# EAGLE schematic button-wall (EAGLE 9.4.2)
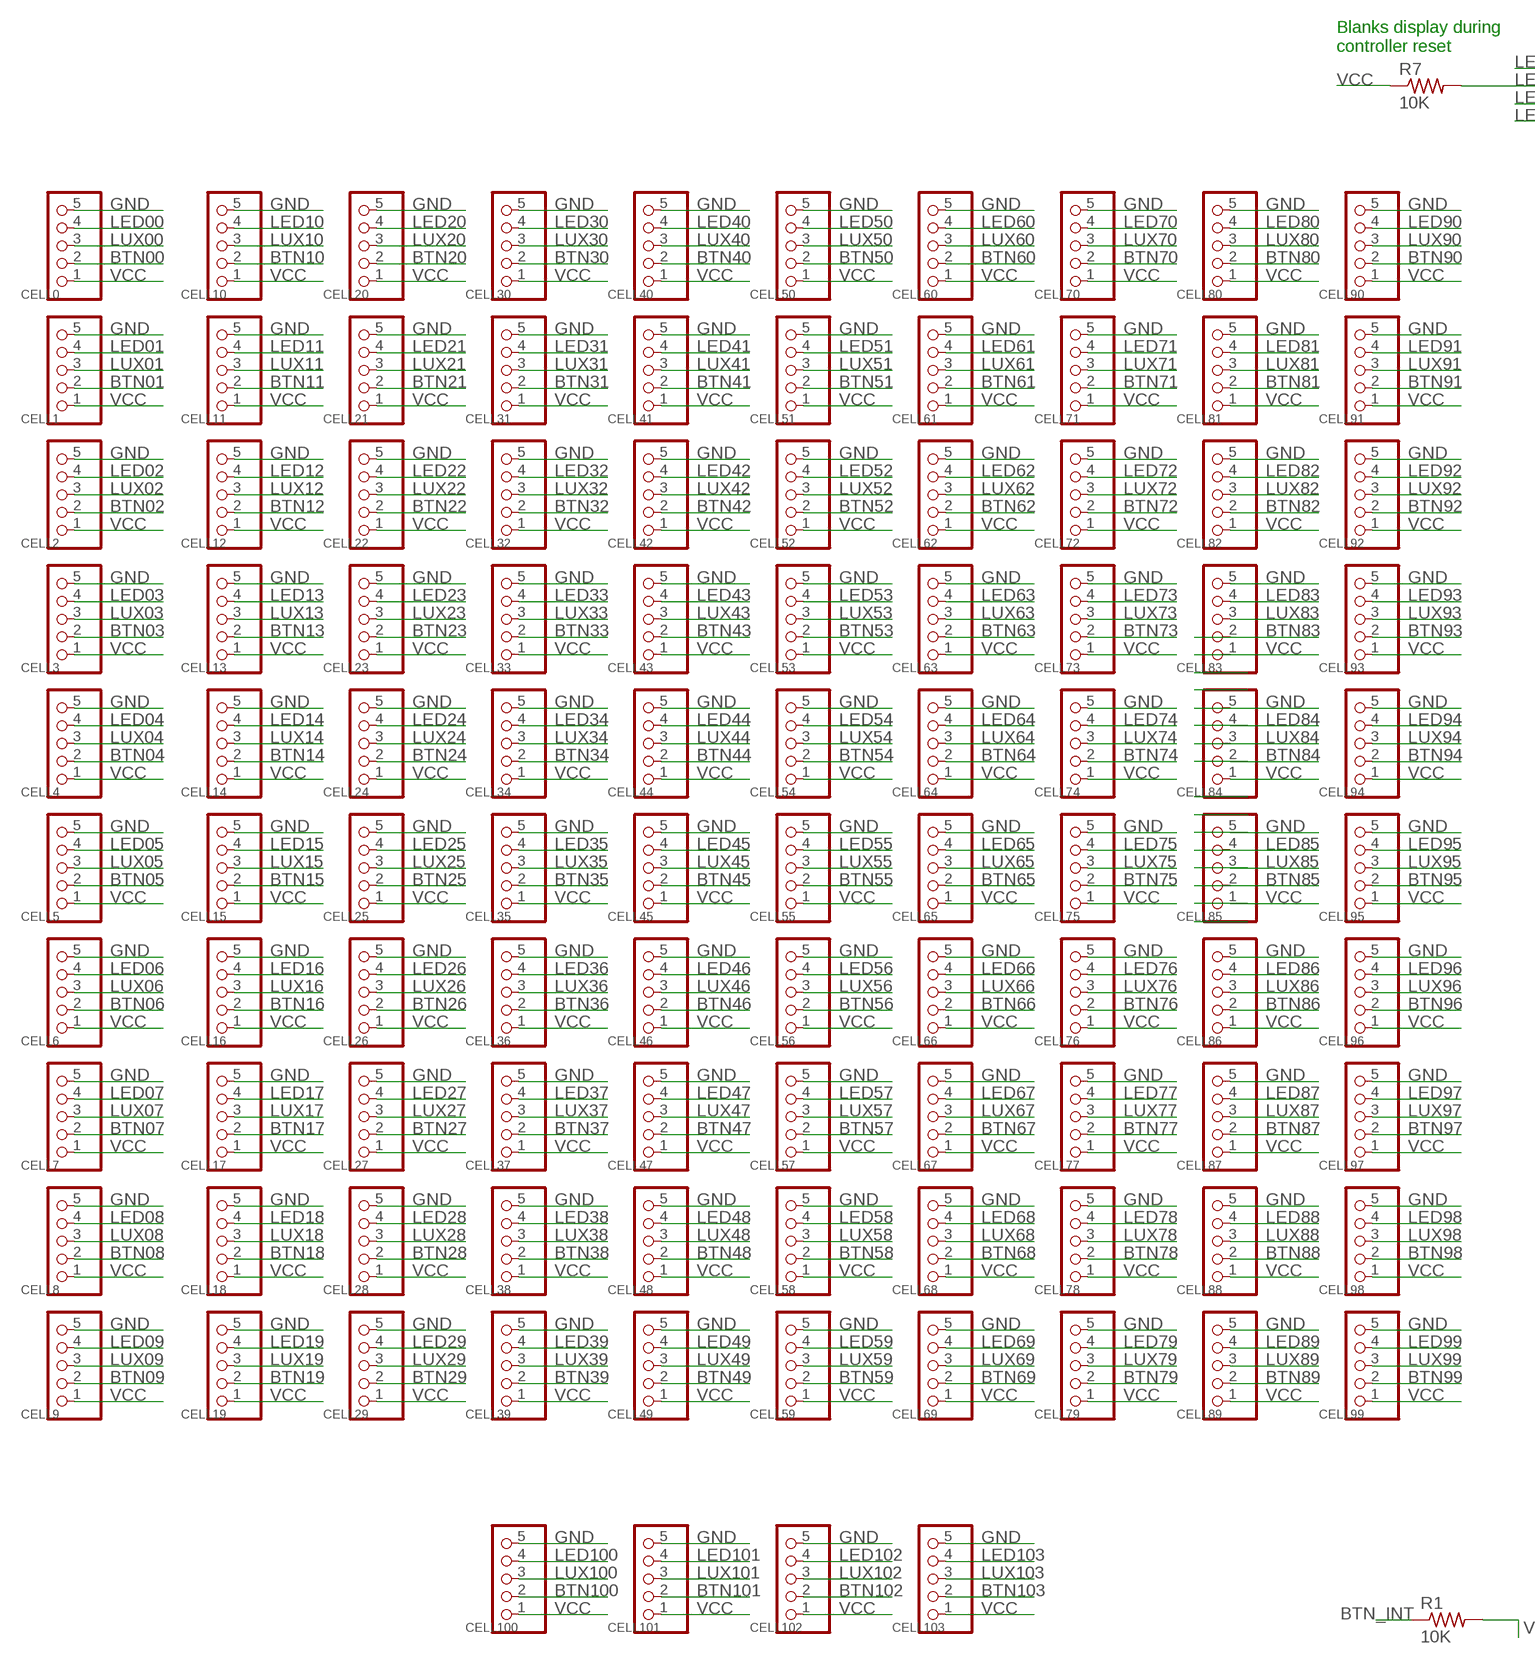
[diagram p0: schematic, sheet 1, part 1 of 2]
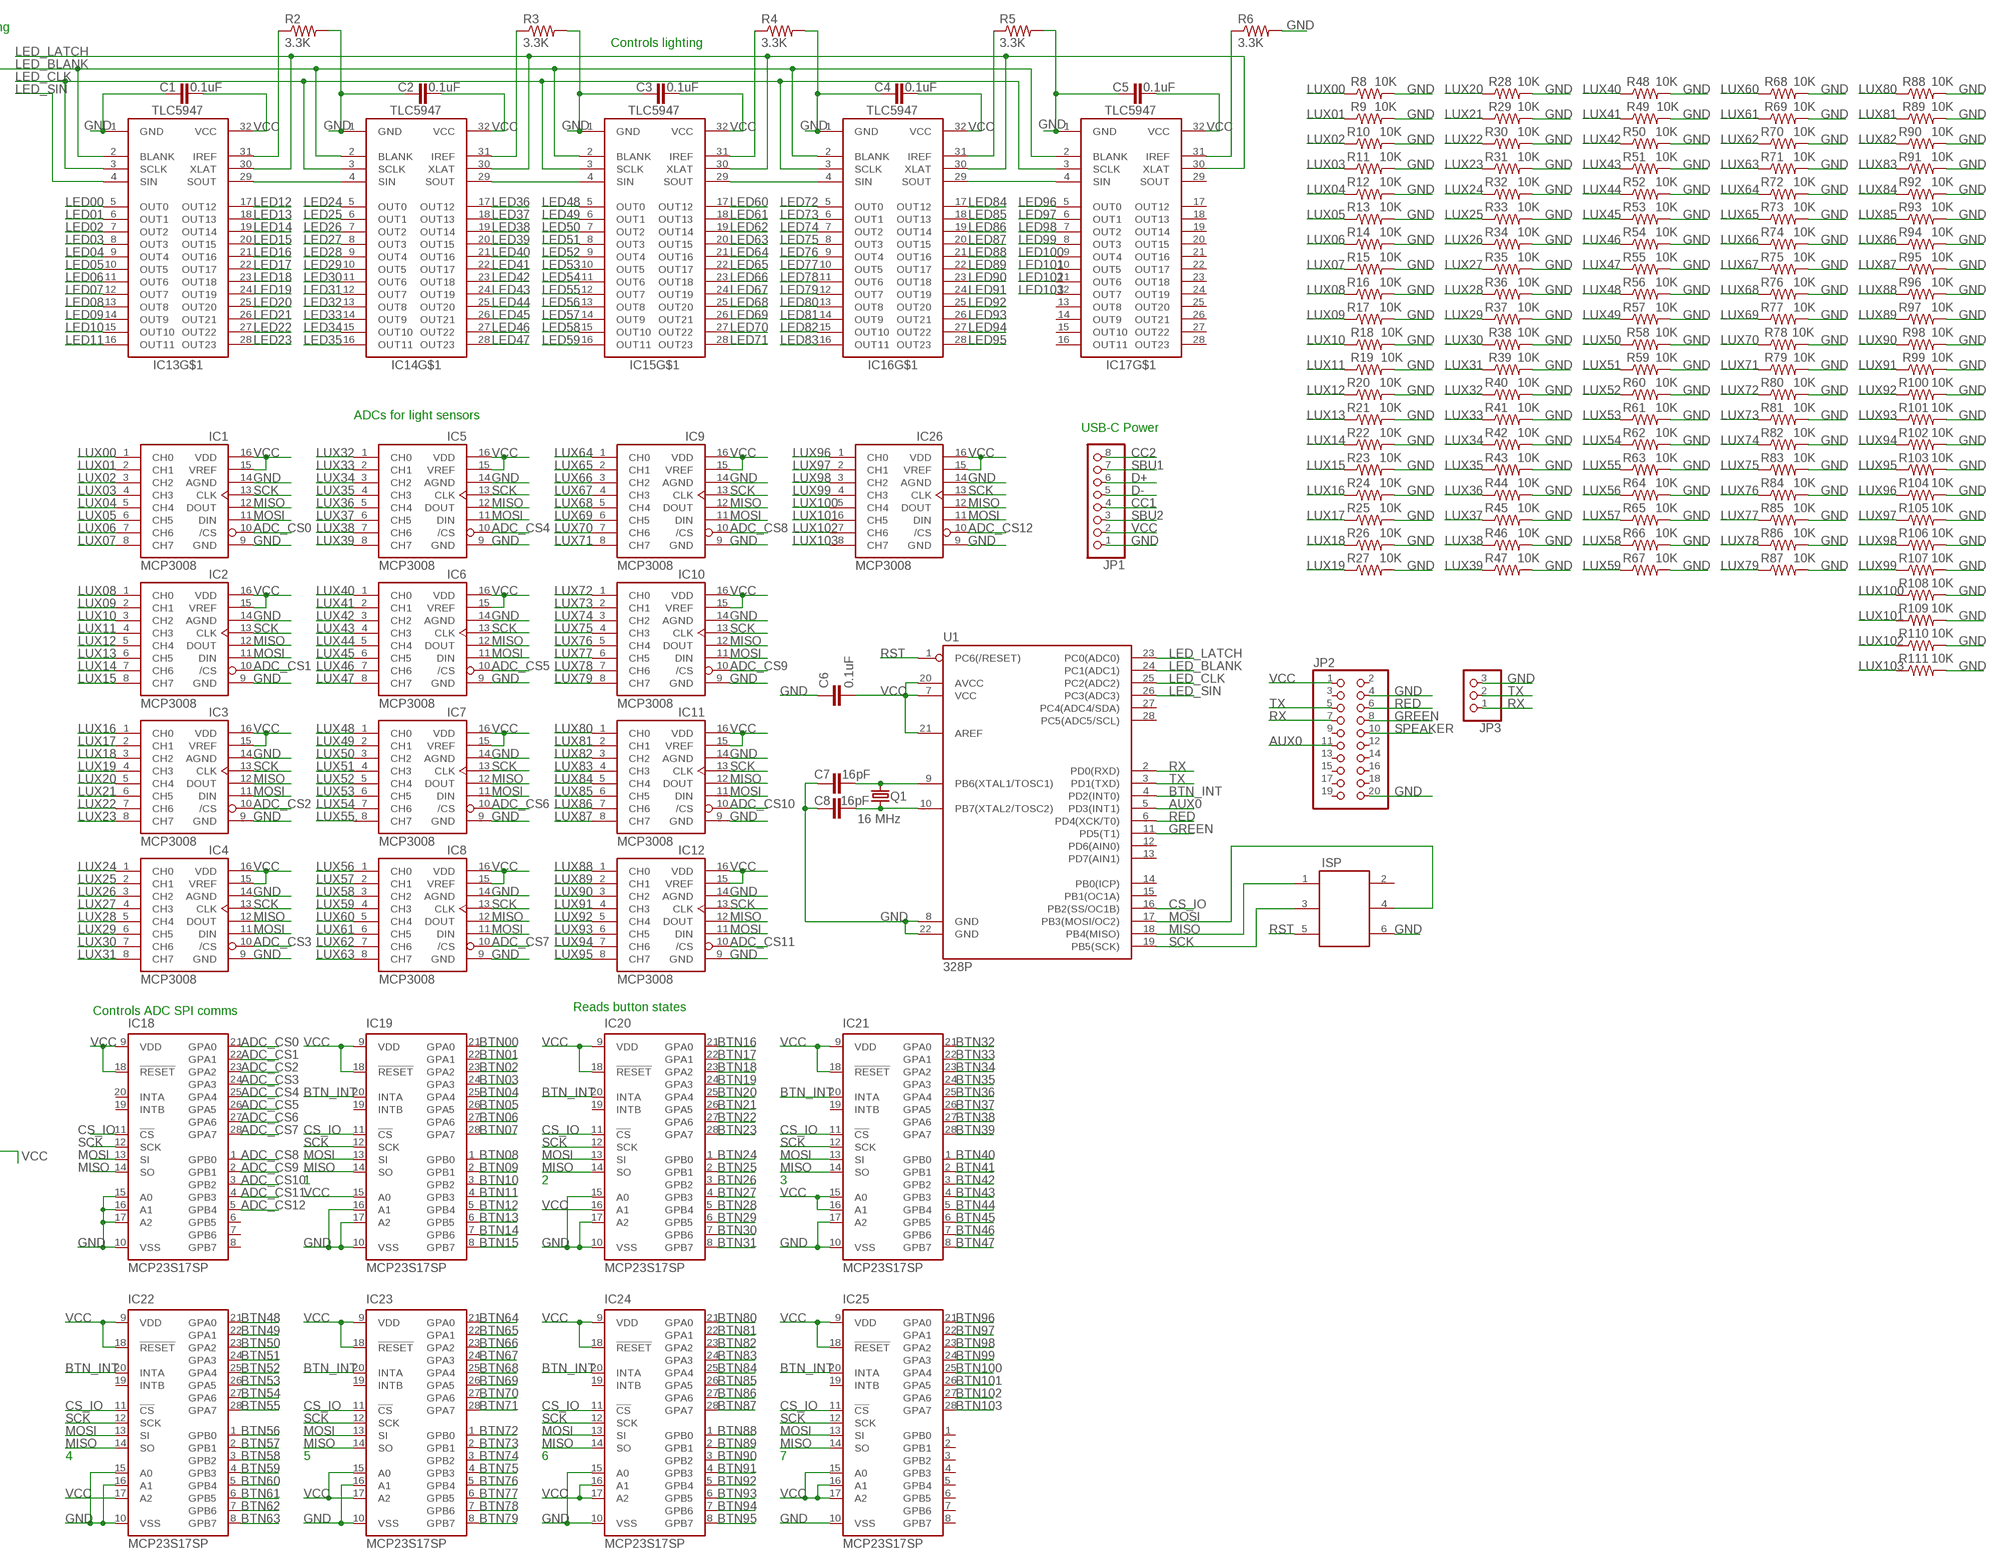
[diagram p1: schematic, sheet 1, part 2 of 2]

## Parts
C1  0.1uF  C-EUC1206  [C1206]
C2  0.1uF  C-EUC1206  [C1206]
C3  0.1uF  C-EUC1206  [C1206]
C4  0.1uF  C-EUC1206  [C1206]
C5  0.1uF  C-EUC1206  [C1206]
C6  0.1uF  C-EUC1206  [C1206]
C7  16pF  C-EUC0805  [C0805]
C8  16pF  C-EUC0805  [C0805]
CELL0  PINHD-1X55X2MM  [1_05X2MM]
CELL1  PINHD-1X55X2MM  [1_05X2MM]
CELL2  PINHD-1X55X2MM  [1_05X2MM]
CELL3  PINHD-1X55X2MM  [1_05X2MM]
CELL4  PINHD-1X55X2MM  [1_05X2MM]
CELL5  PINHD-1X55X2MM  [1_05X2MM]
CELL6  PINHD-1X55X2MM  [1_05X2MM]
CELL7  PINHD-1X55X2MM  [1_05X2MM]
CELL8  PINHD-1X55X2MM  [1_05X2MM]
CELL9  PINHD-1X55X2MM  [1_05X2MM]
CELL10  PINHD-1X55X2MM  [1_05X2MM]
CELL11  PINHD-1X55X2MM  [1_05X2MM]
CELL12  PINHD-1X55X2MM  [1_05X2MM]
CELL13  PINHD-1X55X2MM  [1_05X2MM]
CELL14  PINHD-1X55X2MM  [1_05X2MM]
CELL15  PINHD-1X55X2MM  [1_05X2MM]
CELL16  PINHD-1X55X2MM  [1_05X2MM]
CELL17  PINHD-1X55X2MM  [1_05X2MM]
CELL18  PINHD-1X55X2MM  [1_05X2MM]
CELL19  PINHD-1X55X2MM  [1_05X2MM]
CELL20  PINHD-1X55X2MM  [1_05X2MM]
CELL21  PINHD-1X55X2MM  [1_05X2MM]
CELL22  PINHD-1X55X2MM  [1_05X2MM]
CELL23  PINHD-1X55X2MM  [1_05X2MM]
CELL24  PINHD-1X55X2MM  [1_05X2MM]
CELL25  PINHD-1X55X2MM  [1_05X2MM]
CELL26  PINHD-1X55X2MM  [1_05X2MM]
CELL27  PINHD-1X55X2MM  [1_05X2MM]
CELL28  PINHD-1X55X2MM  [1_05X2MM]
CELL29  PINHD-1X55X2MM  [1_05X2MM]
CELL30  PINHD-1X55X2MM  [1_05X2MM]
CELL31  PINHD-1X55X2MM  [1_05X2MM]
CELL32  PINHD-1X55X2MM  [1_05X2MM]
CELL33  PINHD-1X55X2MM  [1_05X2MM]
CELL34  PINHD-1X55X2MM  [1_05X2MM]
CELL35  PINHD-1X55X2MM  [1_05X2MM]
CELL36  PINHD-1X55X2MM  [1_05X2MM]
CELL37  PINHD-1X55X2MM  [1_05X2MM]
CELL38  PINHD-1X55X2MM  [1_05X2MM]
CELL39  PINHD-1X55X2MM  [1_05X2MM]
CELL40  PINHD-1X55X2MM  [1_05X2MM]
CELL41  PINHD-1X55X2MM  [1_05X2MM]
CELL42  PINHD-1X55X2MM  [1_05X2MM]
CELL43  PINHD-1X55X2MM  [1_05X2MM]
CELL44  PINHD-1X55X2MM  [1_05X2MM]
CELL45  PINHD-1X55X2MM  [1_05X2MM]
CELL46  PINHD-1X55X2MM  [1_05X2MM]
CELL47  PINHD-1X55X2MM  [1_05X2MM]
CELL48  PINHD-1X55X2MM  [1_05X2MM]
CELL49  PINHD-1X55X2MM  [1_05X2MM]
CELL50  PINHD-1X55X2MM  [1_05X2MM]
CELL51  PINHD-1X55X2MM  [1_05X2MM]
CELL52  PINHD-1X55X2MM  [1_05X2MM]
CELL53  PINHD-1X55X2MM  [1_05X2MM]
CELL54  PINHD-1X55X2MM  [1_05X2MM]
CELL55  PINHD-1X55X2MM  [1_05X2MM]
CELL56  PINHD-1X55X2MM  [1_05X2MM]
CELL57  PINHD-1X55X2MM  [1_05X2MM]
CELL58  PINHD-1X55X2MM  [1_05X2MM]
CELL59  PINHD-1X55X2MM  [1_05X2MM]
CELL60  PINHD-1X55X2MM  [1_05X2MM]
CELL61  PINHD-1X55X2MM  [1_05X2MM]
CELL62  PINHD-1X55X2MM  [1_05X2MM]
CELL63  PINHD-1X55X2MM  [1_05X2MM]
CELL64  PINHD-1X55X2MM  [1_05X2MM]
CELL65  PINHD-1X55X2MM  [1_05X2MM]
CELL66  PINHD-1X55X2MM  [1_05X2MM]
CELL67  PINHD-1X55X2MM  [1_05X2MM]
CELL68  PINHD-1X55X2MM  [1_05X2MM]
CELL69  PINHD-1X55X2MM  [1_05X2MM]
CELL70  PINHD-1X55X2MM  [1_05X2MM]
CELL71  PINHD-1X55X2MM  [1_05X2MM]
CELL72  PINHD-1X55X2MM  [1_05X2MM]
CELL73  PINHD-1X55X2MM  [1_05X2MM]
CELL74  PINHD-1X55X2MM  [1_05X2MM]
CELL75  PINHD-1X55X2MM  [1_05X2MM]
CELL76  PINHD-1X55X2MM  [1_05X2MM]
CELL77  PINHD-1X55X2MM  [1_05X2MM]
CELL78  PINHD-1X55X2MM  [1_05X2MM]
CELL79  PINHD-1X55X2MM  [1_05X2MM]
CELL80  PINHD-1X55X2MM  [1_05X2MM]
CELL81  PINHD-1X55X2MM  [1_05X2MM]
CELL82  PINHD-1X55X2MM  [1_05X2MM]
CELL83  PINHD-1X55X2MM  [1_05X2MM]
CELL84  PINHD-1X55X2MM  [1_05X2MM]
CELL85  PINHD-1X55X2MM  [1_05X2MM]
CELL86  PINHD-1X55X2MM  [1_05X2MM]
CELL87  PINHD-1X55X2MM  [1_05X2MM]
CELL88  PINHD-1X55X2MM  [1_05X2MM]
CELL89  PINHD-1X55X2MM  [1_05X2MM]
CELL90  PINHD-1X55X2MM  [1_05X2MM]
CELL91  PINHD-1X55X2MM  [1_05X2MM]
CELL92  PINHD-1X55X2MM  [1_05X2MM]
CELL93  PINHD-1X55X2MM  [1_05X2MM]
CELL94  PINHD-1X55X2MM  [1_05X2MM]
CELL95  PINHD-1X55X2MM  [1_05X2MM]
CELL96  PINHD-1X55X2MM  [1_05X2MM]
CELL97  PINHD-1X55X2MM  [1_05X2MM]
CELL98  PINHD-1X55X2MM  [1_05X2MM]
CELL99  PINHD-1X55X2MM  [1_05X2MM]
CELL100  PINHD-1X55X2MM  [1_05X2MM]
CELL101  PINHD-1X55X2MM  [1_05X2MM]
CELL102  PINHD-1X55X2MM  [1_05X2MM]
CELL103  PINHD-1X55X2MM  [1_05X2MM]
IC1  MCP3008  [DIL16]
IC2  MCP3008  [DIL16]
IC3  MCP3008  [DIL16]
IC4  MCP3008  [DIL16]
IC5  MCP3008  [DIL16]
IC6  MCP3008  [DIL16]
IC7  MCP3008  [DIL16]
IC8  MCP3008  [DIL16]
IC9  MCP3008  [DIL16]
IC10  MCP3008  [DIL16]
IC11  MCP3008  [DIL16]
IC12  MCP3008  [DIL16]
IC13  TLC5947-DAP  [HTSSOP32DAP]
IC14  TLC5947-DAP  [HTSSOP32DAP]
IC15  TLC5947-DAP  [HTSSOP32DAP]
IC16  TLC5947-DAP  [HTSSOP32DAP]
IC17  TLC5947-DAP  [HTSSOP32DAP]
IC18  MCP23S17SP  [DIL28-3]
IC19  MCP23S17SP  [DIL28-3]
IC20  MCP23S17SP  [DIL28-3]
IC21  MCP23S17SP  [DIL28-3]
IC22  MCP23S17SP  [DIL28-3]
IC23  MCP23S17SP  [DIL28-3]
IC24  MCP23S17SP  [DIL28-3]
IC25  MCP23S17SP  [DIL28-3]
IC26  MCP3008  [DIL16]
ISP  61200621621  [61200621621]
JP1  PINHD-1X8CLEANBIG  [1X08-CLEANBIG]
JP2  PINHD-2X10  [2X10]
JP3  PINHD-1X3  [1X03]
Q1  16 MHz  CRYSTALHC49S  [HC49/S]
R1  10K  R-US_R1206  [R1206]
R2  3.3K  R-US_R1206  [R1206]
R3  3.3K  R-US_R1206  [R1206]
R4  3.3K  R-US_R1206  [R1206]
R5  3.3K  R-US_R1206  [R1206]
R6  3.3K  R-US_R1206  [R1206]
R7  10K  R-US_R1206  [R1206]
R8  10K  R-US_R0805  [R0805]
R9  10K  R-US_R0805  [R0805]
R10  10K  R-US_R0805  [R0805]
R11  10K  R-US_R0805  [R0805]
R12  10K  R-US_R0805  [R0805]
R13  10K  R-US_R0805  [R0805]
R14  10K  R-US_R0805  [R0805]
R15  10K  R-US_R0805  [R0805]
R16  10K  R-US_R0805  [R0805]
R17  10K  R-US_R0805  [R0805]
R18  10K  R-US_R0805  [R0805]
R19  10K  R-US_R0805  [R0805]
R20  10K  R-US_R0805  [R0805]
R21  10K  R-US_R0805  [R0805]
R22  10K  R-US_R0805  [R0805]
R23  10K  R-US_R0805  [R0805]
R24  10K  R-US_R0805  [R0805]
R25  10K  R-US_R0805  [R0805]
R26  10K  R-US_R0805  [R0805]
R27  10K  R-US_R0805  [R0805]
R28  10K  R-US_R0805  [R0805]
R29  10K  R-US_R0805  [R0805]
R30  10K  R-US_R0805  [R0805]
R31  10K  R-US_R0805  [R0805]
R32  10K  R-US_R0805  [R0805]
R33  10K  R-US_R0805  [R0805]
R34  10K  R-US_R0805  [R0805]
R35  10K  R-US_R0805  [R0805]
R36  10K  R-US_R0805  [R0805]
R37  10K  R-US_R0805  [R0805]
R38  10K  R-US_R0805  [R0805]
R39  10K  R-US_R0805  [R0805]
R40  10K  R-US_R0805  [R0805]
R41  10K  R-US_R0805  [R0805]
R42  10K  R-US_R0805  [R0805]
R43  10K  R-US_R0805  [R0805]
R44  10K  R-US_R0805  [R0805]
R45  10K  R-US_R0805  [R0805]
R46  10K  R-US_R0805  [R0805]
R47  10K  R-US_R0805  [R0805]
R48  10K  R-US_R0805  [R0805]
R49  10K  R-US_R0805  [R0805]
R50  10K  R-US_R0805  [R0805]
R51  10K  R-US_R0805  [R0805]
R52  10K  R-US_R0805  [R0805]
R53  10K  R-US_R0805  [R0805]
R54  10K  R-US_R0805  [R0805]
R55  10K  R-US_R0805  [R0805]
R56  10K  R-US_R0805  [R0805]
R57  10K  R-US_R0805  [R0805]
R58  10K  R-US_R0805  [R0805]
R59  10K  R-US_R0805  [R0805]
R60  10K  R-US_R0805  [R0805]
R61  10K  R-US_R0805  [R0805]
R62  10K  R-US_R0805  [R0805]
R63  10K  R-US_R0805  [R0805]
R64  10K  R-US_R0805  [R0805]
R65  10K  R-US_R0805  [R0805]
R66  10K  R-US_R0805  [R0805]
R67  10K  R-US_R0805  [R0805]
R68  10K  R-US_R0805  [R0805]
R69  10K  R-US_R0805  [R0805]
R70  10K  R-US_R0805  [R0805]
R71  10K  R-US_R0805  [R0805]
R72  10K  R-US_R0805  [R0805]
R73  10K  R-US_R0805  [R0805]
R74  10K  R-US_R0805  [R0805]
R75  10K  R-US_R0805  [R0805]
R76  10K  R-US_R0805  [R0805]
R77  10K  R-US_R0805  [R0805]
R78  10K  R-US_R0805  [R0805]
R79  10K  R-US_R0805  [R0805]
R80  10K  R-US_R0805  [R0805]
R81  10K  R-US_R0805  [R0805]
R82  10K  R-US_R0805  [R0805]
R83  10K  R-US_R0805  [R0805]
R84  10K  R-US_R0805  [R0805]
R85  10K  R-US_R0805  [R0805]
R86  10K  R-US_R0805  [R0805]
R87  10K  R-US_R0805  [R0805]
R88  10K  R-US_R0805  [R0805]
R89  10K  R-US_R0805  [R0805]
R90  10K  R-US_R0805  [R0805]
R91  10K  R-US_R0805  [R0805]
R92  10K  R-US_R0805  [R0805]
R93  10K  R-US_R0805  [R0805]
R94  10K  R-US_R0805  [R0805]
R95  10K  R-US_R0805  [R0805]
R96  10K  R-US_R0805  [R0805]
R97  10K  R-US_R0805  [R0805]
R98  10K  R-US_R0805  [R0805]
R99  10K  R-US_R0805  [R0805]
R100  10K  R-US_R0805  [R0805]
R101  10K  R-US_R0805  [R0805]
R102  10K  R-US_R0805  [R0805]
R103  10K  R-US_R0805  [R0805]
R104  10K  R-US_R0805  [R0805]
R105  10K  R-US_R0805  [R0805]
R106  10K  R-US_R0805  [R0805]
R107  10K  R-US_R0805  [R0805]
R108  10K  R-US_R0805  [R0805]
R109  10K  R-US_R0805  [R0805]
R110  10K  R-US_R0805  [R0805]
R111  10K  R-US_R0805  [R0805]
U1  328P  ATMEGA328P_PDIP  [DIP28]

## Nets
ADC_CS0: IC1.10(/CS) IC18.21(GPA0)
ADC_CS1: IC2.10(/CS) IC18.22(GPA1)
ADC_CS2: IC3.10(/CS) IC18.23(GPA2)
ADC_CS3: IC4.10(/CS) IC18.24(GPA3)
ADC_CS4: IC5.10(/CS) IC18.25(GPA4)
ADC_CS5: IC6.10(/CS) IC18.26(GPA5)
ADC_CS6: IC7.10(/CS) IC18.27(GPA6)
ADC_CS7: IC8.10(/CS) IC18.28(GPA7)
ADC_CS8: IC9.10(/CS) IC18.1(GPB0)
ADC_CS9: IC10.10(/CS) IC18.2(GPB1)
ADC_CS10: IC11.10(/CS) IC18.3(GPB2)
ADC_CS11: IC12.10(/CS) IC18.4(GPB3)
ADC_CS12: IC18.5(GPB4) IC26.10(/CS)
AUX0: JP2.11 U1.5(PD3(INT1))
BTN00: CELL0.2 IC19.21(GPA0)
BTN01: CELL1.2 IC19.22(GPA1)
BTN02: CELL2.2 IC19.23(GPA2)
BTN03: CELL3.2 IC19.24(GPA3)
BTN04: CELL4.2 IC19.25(GPA4)
BTN05: CELL5.2 IC19.26(GPA5)
BTN06: CELL6.2 IC19.27(GPA6)
BTN07: CELL7.2 IC19.28(GPA7)
BTN08: CELL8.2 IC19.1(GPB0)
BTN09: CELL9.2 IC19.2(GPB1)
BTN10: CELL10.2 IC19.3(GPB2)
BTN11: CELL11.2 IC19.4(GPB3)
BTN12: CELL12.2 IC19.5(GPB4)
BTN13: CELL13.2 IC19.6(GPB5)
BTN14: CELL14.2 IC19.7(GPB6)
BTN15: CELL15.2 IC19.8(GPB7)
BTN16: CELL16.2 IC20.21(GPA0)
BTN17: CELL17.2 IC20.22(GPA1)
BTN18: CELL18.2 IC20.23(GPA2)
BTN19: CELL19.2 IC20.24(GPA3)
BTN20: CELL20.2 IC20.25(GPA4)
BTN21: CELL21.2 IC20.26(GPA5)
BTN22: CELL22.2 IC20.27(GPA6)
BTN23: CELL23.2 IC20.28(GPA7)
BTN24: CELL24.2 IC20.1(GPB0)
BTN25: CELL25.2 IC20.2(GPB1)
BTN26: CELL26.2 IC20.3(GPB2)
BTN27: CELL27.2 IC20.4(GPB3)
BTN28: CELL28.2 IC20.5(GPB4)
BTN29: CELL29.2 IC20.6(GPB5)
BTN30: CELL30.2 IC20.7(GPB6)
BTN31: CELL31.2 IC20.8(GPB7)
BTN32: CELL32.2 IC21.21(GPA0)
BTN33: CELL33.2 IC21.22(GPA1)
BTN34: CELL34.2 IC21.23(GPA2)
BTN35: CELL35.2 IC21.24(GPA3)
BTN36: CELL36.2 IC21.25(GPA4)
BTN37: CELL37.2 IC21.26(GPA5)
BTN38: CELL38.2 IC21.27(GPA6)
BTN39: CELL39.2 IC21.28(GPA7)
BTN40: CELL40.2 IC21.1(GPB0)
BTN41: CELL41.2 IC21.2(GPB1)
BTN42: CELL42.2 IC21.3(GPB2)
BTN43: CELL43.2 IC21.4(GPB3)
BTN44: CELL44.2 IC21.5(GPB4)
BTN45: CELL45.2 IC21.6(GPB5)
BTN46: CELL46.2 IC21.7(GPB6)
BTN47: CELL47.2 IC21.8(GPB7)
BTN48: CELL48.2 IC22.21(GPA0)
BTN49: CELL49.2 IC22.22(GPA1)
BTN50: CELL50.2 IC22.23(GPA2)
BTN51: CELL51.2 IC22.24(GPA3)
BTN52: CELL52.2 IC22.25(GPA4)
BTN53: CELL53.2 IC22.26(GPA5)
BTN54: CELL54.2 IC22.27(GPA6)
BTN55: CELL55.2 IC22.28(GPA7)
BTN56: CELL56.2 IC22.1(GPB0)
BTN57: CELL57.2 IC22.2(GPB1)
BTN58: CELL58.2 IC22.3(GPB2)
BTN59: CELL59.2 IC22.4(GPB3)
BTN60: CELL60.2 IC22.5(GPB4)
BTN61: CELL61.2 IC22.6(GPB5)
BTN62: CELL62.2 IC22.7(GPB6)
BTN63: CELL63.2 IC22.8(GPB7)
BTN64: CELL64.2 IC23.21(GPA0)
BTN65: CELL65.2 IC23.22(GPA1)
BTN66: CELL66.2 IC23.23(GPA2)
BTN67: CELL67.2 IC23.24(GPA3)
BTN68: CELL68.2 IC23.25(GPA4)
BTN69: CELL69.2 IC23.26(GPA5)
BTN70: CELL70.2 IC23.27(GPA6)
BTN71: CELL71.2 IC23.28(GPA7)
BTN72: CELL72.2 IC23.1(GPB0)
BTN73: CELL73.2 IC23.2(GPB1)
BTN74: CELL74.2 IC23.3(GPB2)
BTN75: CELL75.2 IC23.4(GPB3)
BTN76: CELL76.2 IC23.5(GPB4)
BTN77: CELL77.2 IC23.6(GPB5)
BTN78: CELL78.2 IC23.7(GPB6)
BTN79: CELL79.2 IC23.8(GPB7)
BTN80: CELL80.2 IC24.21(GPA0)
BTN81: CELL81.2 IC24.22(GPA1)
BTN82: CELL82.2 IC24.23(GPA2)
BTN83: CELL83.2 IC24.24(GPA3)
BTN84: CELL84.2 IC24.25(GPA4)
BTN85: CELL85.2 IC24.26(GPA5)
BTN86: CELL86.2 IC24.27(GPA6)
BTN87: CELL87.2 IC24.28(GPA7)
BTN88: CELL88.2 IC24.1(GPB0)
BTN89: CELL89.2 IC24.2(GPB1)
BTN90: CELL90.2 IC24.3(GPB2)
BTN91: CELL91.2 IC24.4(GPB3)
BTN92: CELL92.2 IC24.5(GPB4)
BTN93: CELL93.2 IC24.6(GPB5)
BTN94: CELL94.2 IC24.7(GPB6)
BTN95: CELL95.2 IC24.8(GPB7)
BTN96: CELL96.2 IC25.21(GPA0)
BTN97: CELL97.2 IC25.22(GPA1)
BTN98: CELL98.2 IC25.23(GPA2)
BTN99: CELL99.2 IC25.24(GPA3)
BTN100: CELL100.2 IC25.25(GPA4)
BTN101: CELL101.2 IC25.26(GPA5)
BTN102: CELL102.2 IC25.27(GPA6)
BTN103: CELL103.2 IC25.28(GPA7)
BTN_INT: IC19.20(INTA) IC20.20(INTA) IC21.20(INTA) IC22.20(INTA) IC23.20(INTA) IC24.20(INTA) IC25.20(INTA) R1.1 U1.4(PD2(INT0))
CC1: JP1.4
CC2: JP1.8
CS_IO: IC18.11(!CS) IC19.11(!CS) IC20.11(!CS) IC21.11(!CS) IC22.11(!CS) IC23.11(!CS) IC24.11(!CS) IC25.11(!CS) U1.16(PB2(SS/OC1B))
D+: JP1.6
D-: JP1.5
GND: C1.1 C2.1 C3.1 C4.1 C5.1 C6.1 C7.1 C8.1 CELL0.5 CELL1.5 CELL2.5 CELL3.5 CELL4.5 CELL5.5 CELL6.5 CELL7.5 CELL8.5 CELL9.5 CELL10.5 CELL11.5 CELL12.5 CELL13.5 CELL14.5 CELL15.5 CELL16.5 CELL17.5 CELL18.5 CELL19.5 CELL20.5 CELL21.5 CELL22.5 CELL23.5 CELL24.5 CELL25.5 CELL26.5 CELL27.5 CELL28.5 CELL29.5 CELL30.5 CELL31.5 CELL32.5 CELL33.5 CELL34.5 CELL35.5 CELL36.5 CELL37.5 CELL38.5 CELL39.5 CELL40.5 CELL41.5 CELL42.5 CELL43.5 CELL44.5 CELL45.5 CELL46.5 CELL47.5 CELL48.5 CELL49.5 CELL50.5 CELL51.5 CELL52.5 CELL53.5 CELL54.5 CELL55.5 CELL56.5 CELL57.5 CELL58.5 CELL59.5 CELL60.5 CELL61.5 CELL62.5 CELL63.5 CELL64.5 CELL65.5 CELL66.5 CELL67.5 CELL68.5 CELL69.5 CELL70.5 CELL71.5 CELL72.5 CELL73.5 CELL74.5 CELL75.5 CELL76.5 CELL77.5 CELL78.5 CELL79.5 CELL80.5 CELL81.5 CELL82.5 CELL83.5 CELL84.5 CELL85.5 CELL86.5 CELL87.5 CELL88.5 CELL89.5 CELL90.5 CELL91.5 CELL92.5 CELL93.5 CELL94.5 CELL95.5 CELL96.5 CELL97.5 CELL98.5 CELL99.5 CELL100.5 CELL101.5 CELL102.5 CELL103.5 IC1.9(GND) IC1.14(AGND) IC2.9(GND) IC2.14(AGND) IC3.9(GND) IC3.14(AGND) IC4.9(GND) IC4.14(AGND) IC5.9(GND) IC5.14(AGND) IC6.9(GND) IC6.14(AGND) IC7.9(GND) IC7.14(AGND) IC8.9(GND) IC8.14(AGND) IC9.9(GND) IC9.14(AGND) IC10.9(GND) IC10.14(AGND) IC11.9(GND) IC11.14(AGND) IC12.9(GND) IC12.14(AGND) IC13.1(GND) IC14.1(GND) IC15.1(GND) IC16.1(GND) IC17.1(GND) IC18.10(VSS) IC18.15(A0) IC18.16(A1) IC18.17(A2) IC19.10(VSS) IC19.16(A1) IC19.17(A2) IC20.10(VSS) IC20.15(A0) IC20.17(A2) IC21.10(VSS) IC21.17(A2) IC22.10(VSS) IC22.15(A0) IC22.16(A1) IC23.10(VSS) IC23.16(A1) IC24.10(VSS) IC24.15(A0) IC25.10(VSS) IC26.9(GND) IC26.14(AGND) ISP.6 JP1.1 JP2.4 JP2.20 JP3.3 R2.2 R3.2 R4.2 R5.2 R6.2 R8.2 R9.2 R10.2 R11.2 R12.2 R13.2 R14.2 R15.2 R16.2 R17.2 R18.2 R19.2 R20.2 R21.2 R22.2 R23.2 R24.2 R25.2 R26.2 R27.2 R28.2 R29.2 R30.2 R31.2 R32.2 R33.2 R34.2 R35.2 R36.2 R37.2 R38.2 R39.2 R40.2 R41.2 R42.2 R43.2 R44.2 R45.2 R46.2 R47.2 R48.2 R49.2 R50.2 R51.2 R52.2 R53.2 R54.2 R55.2 R56.2 R57.2 R58.2 R59.2 R60.2 R61.2 R62.2 R63.2 R64.2 R65.2 R66.2 R67.2 R68.2 R69.2 R70.2 R71.2 R72.2 R73.2 R74.2 R75.2 R76.2 R77.2 R78.2 R79.2 R80.2 R81.2 R82.2 R83.2 R84.2 R85.2 R86.2 R87.2 R88.2 R89.2 R90.2 R91.2 R92.2 R93.2 R94.2 R95.2 R96.2 R97.2 R98.2 R99.2 R100.2 R101.2 R102.2 R103.2 R104.2 R105.2 R106.2 R107.2 R108.2 R109.2 R110.2 R111.2 U1.8(GND) U1.22(GND)
GREEN: JP2.8 U1.11(PD5(T1))
LED00: CELL0.4 IC13.5(OUT0)
LED01: CELL1.4 IC13.6(OUT1)
LED02: CELL2.4 IC13.7(OUT2)
LED03: CELL3.4 IC13.8(OUT3)
LED04: CELL4.4 IC13.9(OUT4)
LED05: CELL5.4 IC13.10(OUT5)
LED06: CELL6.4 IC13.11(OUT6)
LED07: CELL7.4 IC13.12(OUT7)
LED08: CELL8.4 IC13.13(OUT8)
LED09: CELL9.4 IC13.14(OUT9)
LED10: CELL10.4 IC13.15(OUT10)
LED11: CELL11.4 IC13.16(OUT11)
LED12: CELL12.4 IC13.17(OUT12)
LED13: CELL13.4 IC13.18(OUT13)
LED14: CELL14.4 IC13.19(OUT14)
LED15: CELL15.4 IC13.20(OUT15)
LED16: CELL16.4 IC13.21(OUT16)
LED17: CELL17.4 IC13.22(OUT17)
LED18: CELL18.4 IC13.23(OUT18)
LED19: CELL19.4 IC13.24(OUT19)
LED20: CELL20.4 IC13.25(OUT20)
LED21: CELL21.4 IC13.26(OUT21)
LED22: CELL22.4 IC13.27(OUT22)
LED23: CELL23.4 IC13.28(OUT23)
LED24: CELL24.4 IC14.5(OUT0)
LED25: CELL25.4 IC14.6(OUT1)
LED26: CELL26.4 IC14.7(OUT2)
LED27: CELL27.4 IC14.8(OUT3)
LED28: CELL28.4 IC14.9(OUT4)
LED29: CELL29.4 IC14.10(OUT5)
LED30: CELL30.4 IC14.11(OUT6)
LED31: CELL31.4 IC14.12(OUT7)
LED32: CELL32.4 IC14.13(OUT8)
LED33: CELL33.4 IC14.14(OUT9)
LED34: CELL34.4 IC14.15(OUT10)
LED35: CELL35.4 IC14.16(OUT11)
LED36: CELL36.4 IC14.17(OUT12)
LED37: CELL37.4 IC14.18(OUT13)
LED38: CELL38.4 IC14.19(OUT14)
LED39: CELL39.4 IC14.20(OUT15)
LED40: CELL40.4 IC14.21(OUT16)
LED41: CELL41.4 IC14.22(OUT17)
LED42: CELL42.4 IC14.23(OUT18)
LED43: CELL43.4 IC14.24(OUT19)
LED44: CELL44.4 IC14.25(OUT20)
LED45: CELL45.4 IC14.26(OUT21)
LED46: CELL46.4 IC14.27(OUT22)
LED47: CELL47.4 IC14.28(OUT23)
LED48: CELL48.4 IC15.5(OUT0)
LED49: CELL49.4 IC15.6(OUT1)
LED50: CELL50.4 IC15.7(OUT2)
LED51: CELL51.4 IC15.8(OUT3)
LED52: CELL52.4 IC15.9(OUT4)
LED53: CELL53.4 IC15.10(OUT5)
LED54: CELL54.4 IC15.11(OUT6)
LED55: CELL55.4 IC15.12(OUT7)
LED56: CELL56.4 IC15.13(OUT8)
LED57: CELL57.4 IC15.14(OUT9)
LED58: CELL58.4 IC15.15(OUT10)
LED59: CELL59.4 IC15.16(OUT11)
LED60: CELL60.4 IC15.17(OUT12)
LED61: CELL61.4 IC15.18(OUT13)
LED62: CELL62.4 IC15.19(OUT14)
LED63: CELL63.4 IC15.20(OUT15)
LED64: CELL64.4 IC15.21(OUT16)
LED65: CELL65.4 IC15.22(OUT17)
LED66: CELL66.4 IC15.23(OUT18)
LED67: CELL67.4 IC15.24(OUT19)
LED68: CELL68.4 IC15.25(OUT20)
LED69: CELL69.4 IC15.26(OUT21)
LED70: CELL70.4 IC15.27(OUT22)
LED71: CELL71.4 IC15.28(OUT23)
LED72: CELL72.4 IC16.5(OUT0)
LED73: CELL73.4 IC16.6(OUT1)
LED74: CELL74.4 IC16.7(OUT2)
LED75: CELL75.4 IC16.8(OUT3)
LED76: CELL76.4 IC16.9(OUT4)
LED77: CELL77.4 IC16.10(OUT5)
LED78: CELL78.4 IC16.11(OUT6)
LED79: CELL79.4 IC16.12(OUT7)
LED80: CELL80.4 IC16.13(OUT8)
LED81: CELL81.4 IC16.14(OUT9)
LED82: CELL82.4 IC16.15(OUT10)
LED83: CELL83.4 IC16.16(OUT11)
LED84: CELL84.4 IC16.17(OUT12)
LED85: CELL85.4 IC16.18(OUT13)
LED86: CELL86.4 IC16.19(OUT14)
LED87: CELL87.4 IC16.20(OUT15)
LED88: CELL88.4 IC16.21(OUT16)
LED89: CELL89.4 IC16.22(OUT17)
LED90: CELL90.4 IC16.23(OUT18)
LED91: CELL91.4 IC16.24(OUT19)
LED92: CELL92.4 IC16.25(OUT20)
LED93: CELL93.4 IC16.26(OUT21)
LED94: CELL94.4 IC16.27(OUT22)
LED95: CELL95.4 IC16.28(OUT23)
LED96: CELL96.4 IC17.5(OUT0)
LED97: CELL97.4 IC17.6(OUT1)
LED98: CELL98.4 IC17.7(OUT2)
LED99: CELL99.4 IC17.8(OUT3)
LED100: CELL100.4 IC17.9(OUT4)
LED101: CELL101.4 IC17.10(OUT5)
LED102: CELL102.4 IC17.11(OUT6)
LED103: CELL103.4 IC17.12(OUT7)
LED_BLANK: IC13.2(BLANK) IC14.2(BLANK) IC15.2(BLANK) IC16.2(BLANK) IC17.2(BLANK) R7.2 U1.24(PC1(ADC1))
LED_CLK: IC13.3(SCLK) IC14.3(SCLK) IC15.3(SCLK) IC16.3(SCLK) IC17.3(SCLK) U1.25(PC2(ADC2))
LED_LATCH: IC13.30(XLAT) IC14.30(XLAT) IC15.30(XLAT) IC16.30(XLAT) IC17.30(XLAT) U1.23(PC0(ADC0))
LED_SIN: IC13.4(SIN) U1.26(PC3(ADC3))
LUX00: CELL0.3 IC1.1(CH0) R8.1
LUX01: CELL1.3 IC1.2(CH1) R9.1
LUX02: CELL2.3 IC1.3(CH2) R10.1
LUX03: CELL3.3 IC1.4(CH3) R11.1
LUX04: CELL4.3 IC1.5(CH4) R12.1
LUX05: CELL5.3 IC1.6(CH5) R13.1
LUX06: CELL6.3 IC1.7(CH6) R14.1
LUX07: CELL7.3 IC1.8(CH7) R15.1
LUX08: CELL8.3 IC2.1(CH0) R16.1
LUX09: CELL9.3 IC2.2(CH1) R17.1
LUX10: CELL10.3 IC2.3(CH2) R18.1
LUX11: CELL11.3 IC2.4(CH3) R19.1
LUX12: CELL12.3 IC2.5(CH4) R20.1
LUX13: CELL13.3 IC2.6(CH5) R21.1
LUX14: CELL14.3 IC2.7(CH6) R22.1
LUX15: CELL15.3 IC2.8(CH7) R23.1
LUX16: CELL16.3 IC3.1(CH0) R24.1
LUX17: CELL17.3 IC3.2(CH1) R25.1
LUX18: CELL18.3 IC3.3(CH2) R26.1
LUX19: CELL19.3 IC3.4(CH3) R27.1
LUX20: CELL20.3 IC3.5(CH4) R28.1
LUX21: CELL21.3 IC3.6(CH5) R29.1
LUX22: CELL22.3 IC3.7(CH6) R30.1
LUX23: CELL23.3 IC3.8(CH7) R31.1
LUX24: CELL24.3 IC4.1(CH0) R32.1
LUX25: CELL25.3 IC4.2(CH1) R33.1
LUX26: CELL26.3 IC4.3(CH2) R34.1
LUX27: CELL27.3 IC4.4(CH3) R35.1
LUX28: CELL28.3 IC4.5(CH4) R36.1
LUX29: CELL29.3 IC4.6(CH5) R37.1
LUX30: CELL30.3 IC4.7(CH6) R38.1
LUX31: CELL31.3 IC4.8(CH7) R39.1
LUX32: CELL32.3 IC5.1(CH0) R40.1
LUX33: CELL33.3 IC5.2(CH1) R41.1
LUX34: CELL34.3 IC5.3(CH2) R42.1
LUX35: CELL35.3 IC5.4(CH3) R43.1
LUX36: CELL36.3 IC5.5(CH4) R44.1
LUX37: CELL37.3 IC5.6(CH5) R45.1
LUX38: CELL38.3 IC5.7(CH6) R46.1
LUX39: CELL39.3 IC5.8(CH7) R47.1
LUX40: CELL40.3 IC6.1(CH0) R48.1
LUX41: CELL41.3 IC6.2(CH1) R49.1
LUX42: CELL42.3 IC6.3(CH2) R50.1
LUX43: CELL43.3 IC6.4(CH3) R51.1
LUX44: CELL44.3 IC6.5(CH4) R52.1
LUX45: CELL45.3 IC6.6(CH5) R53.1
LUX46: CELL46.3 IC6.7(CH6) R54.1
LUX47: CELL47.3 IC6.8(CH7) R55.1
LUX48: CELL48.3 IC7.1(CH0) R56.1
LUX49: CELL49.3 IC7.2(CH1) R57.1
LUX50: CELL50.3 IC7.3(CH2) R58.1
LUX51: CELL51.3 IC7.4(CH3) R59.1
LUX52: CELL52.3 IC7.5(CH4) R60.1
LUX53: CELL53.3 IC7.6(CH5) R61.1
LUX54: CELL54.3 IC7.7(CH6) R62.1
LUX55: CELL55.3 R63.1
LUX55.: IC7.8(CH7)
LUX56: CELL56.3 IC8.1(CH0) R64.1
LUX57: CELL57.3 IC8.2(CH1) R65.1
LUX58: CELL58.3 IC8.3(CH2) R66.1
LUX59: CELL59.3 IC8.4(CH3) R67.1
LUX60: CELL60.3 IC8.5(CH4) R68.1
LUX61: CELL61.3 IC8.6(CH5) R69.1
LUX62: CELL62.3 IC8.7(CH6) R70.1
LUX63: CELL63.3 IC8.8(CH7) R71.1
LUX64: CELL64.3 IC9.1(CH0) R72.1
LUX65: CELL65.3 IC9.2(CH1) R73.1
LUX66: CELL66.3 IC9.3(CH2) R74.1
LUX67: CELL67.3 IC9.4(CH3) R75.1
LUX68: CELL68.3 IC9.5(CH4) R76.1
LUX69: CELL69.3 IC9.6(CH5) R77.1
LUX70: CELL70.3 IC9.7(CH6) R78.1
LUX71: CELL71.3 IC9.8(CH7) R79.1
LUX72: CELL72.3 IC10.1(CH0) R80.1
LUX73: CELL73.3 IC10.2(CH1) R81.1
LUX74: CELL74.3 IC10.3(CH2) R82.1
LUX75: CELL75.3 IC10.4(CH3) R83.1
LUX76: CELL76.3 IC10.5(CH4) R84.1
LUX77: CELL77.3 IC10.6(CH5) R85.1
LUX78: CELL78.3 IC10.7(CH6) R86.1
LUX79: CELL79.3 IC10.8(CH7) R87.1
LUX80: CELL80.3 IC11.1(CH0) R88.1
LUX81: CELL81.3 IC11.2(CH1) R89.1
LUX82: CELL82.3 IC11.3(CH2) R90.1
LUX83: CELL83.3 IC11.4(CH3) R91.1
LUX84: CELL84.3 IC11.5(CH4) R92.1
LUX85: CELL85.3 IC11.6(CH5) R93.1
LUX86: CELL86.3 IC11.7(CH6) R94.1
LUX87: CELL87.3 IC11.8(CH7) R95.1
LUX88: CELL88.3 IC12.1(CH0) R96.1
LUX89: CELL89.3 IC12.2(CH1) R97.1
LUX90: CELL90.3 IC12.3(CH2) R98.1
LUX91: CELL91.3 IC12.4(CH3) R99.1
LUX92: CELL92.3 IC12.5(CH4) R100.1
LUX93: CELL93.3 IC12.6(CH5) R101.1
LUX94: CELL94.3 IC12.7(CH6) R102.1
LUX95: CELL95.3 IC12.8(CH7) R103.1
LUX96: CELL96.3 IC26.1(CH0) R104.1
LUX97: CELL97.3 IC26.2(CH1) R105.1
LUX98: CELL98.3 IC26.3(CH2) R106.1
LUX99: CELL99.3 IC26.4(CH3) R107.1
LUX100: CELL100.3 IC26.5(CH4) R108.1
LUX101: CELL101.3 IC26.6(CH5) R109.1
LUX102: CELL102.3 IC26.7(CH6) R110.1
LUX103: CELL103.3 IC26.8(CH7) R111.1
MISO: IC1.12(DOUT) IC2.12(DOUT) IC3.12(DOUT) IC4.12(DOUT) IC5.12(DOUT) IC6.12(DOUT) IC7.12(DOUT) IC8.12(DOUT) IC9.12(DOUT) IC10.12(DOUT) IC11.12(DOUT) IC12.12(DOUT) IC18.14(SO) IC19.14(SO) IC20.14(SO) IC21.14(SO) IC22.14(SO) IC23.14(SO) IC24.14(SO) IC25.14(SO) IC26.12(DOUT) ISP.1 U1.18(PB4(MISO))
MOSI: IC1.11(DIN) IC2.11(DIN) IC3.11(DIN) IC4.11(DIN) IC5.11(DIN) IC6.11(DIN) IC7.11(DIN) IC8.11(DIN) IC9.11(DIN) IC10.11(DIN) IC11.11(DIN) IC12.11(DIN) IC18.13(SI) IC19.13(SI) IC20.13(SI) IC21.13(SI) IC22.13(SI) IC23.13(SI) IC24.13(SI) IC25.13(SI) IC26.11(DIN) ISP.4 U1.17(PB3(MOSI/OC2))
N$1: IC13.31(IREF) R2.1
N$2: C7.2 Q1.2 U1.9(PB6(XTAL1/TOSC1))
N$3: C8.2 Q1.1 U1.10(PB7(XTAL2/TOSC2))
N$25: IC13.29(SOUT) IC14.4(SIN)
N$26: IC14.29(SOUT) IC15.4(SIN)
N$27: IC15.29(SOUT) IC16.4(SIN)
N$28: IC16.29(SOUT) IC17.4(SIN)
N$29: IC14.31(IREF) R3.1
N$30: IC16.31(IREF) R5.1
N$131: IC15.31(IREF) R4.1
N$132: IC17.31(IREF) R6.1
RED: JP2.6 U1.6(PD4(XCK/T0))
RST: ISP.5 U1.1(PC6(/RESET))
RX: JP2.7 JP3.1 U1.2(PD0(RXD))
SBU1: JP1.7
SBU2: JP1.3
SCK: IC1.13(CLK) IC2.13(CLK) IC3.13(CLK) IC4.13(CLK) IC5.13(CLK) IC6.13(CLK) IC7.13(CLK) IC8.13(CLK) IC9.13(CLK) IC10.13(CLK) IC11.13(CLK) IC12.13(CLK) IC18.12(SCK) IC19.12(SCK) IC20.12(SCK) IC21.12(SCK) IC22.12(SCK) IC23.12(SCK) IC24.12(SCK) IC25.12(SCK) IC26.13(CLK) ISP.3 U1.19(PB5(SCK))
SPEAKER: JP2.10
TX: JP2.5 JP3.2 U1.3(PD1(TXD))
VCC: C1.2 C2.2 C3.2 C4.2 C5.2 C6.2 CELL0.1 CELL1.1 CELL2.1 CELL3.1 CELL4.1 CELL5.1 CELL6.1 CELL7.1 CELL8.1 CELL9.1 CELL10.1 CELL11.1 CELL12.1 CELL13.1 CELL14.1 CELL15.1 CELL16.1 CELL17.1 CELL18.1 CELL19.1 CELL20.1 CELL21.1 CELL22.1 CELL23.1 CELL24.1 CELL25.1 CELL26.1 CELL27.1 CELL28.1 CELL29.1 CELL30.1 CELL31.1 CELL32.1 CELL33.1 CELL34.1 CELL35.1 CELL36.1 CELL37.1 CELL38.1 CELL39.1 CELL40.1 CELL41.1 CELL42.1 CELL43.1 CELL44.1 CELL45.1 CELL46.1 CELL47.1 CELL48.1 CELL49.1 CELL50.1 CELL51.1 CELL52.1 CELL53.1 CELL54.1 CELL55.1 CELL56.1 CELL57.1 CELL58.1 CELL59.1 CELL60.1 CELL61.1 CELL62.1 CELL63.1 CELL64.1 CELL65.1 CELL66.1 CELL67.1 CELL68.1 CELL69.1 CELL70.1 CELL71.1 CELL72.1 CELL73.1 CELL74.1 CELL75.1 CELL76.1 CELL77.1 CELL78.1 CELL79.1 CELL80.1 CELL81.1 CELL82.1 CELL83.1 CELL84.1 CELL85.1 CELL86.1 CELL87.1 CELL88.1 CELL89.1 CELL90.1 CELL91.1 CELL92.1 CELL93.1 CELL94.1 CELL95.1 CELL96.1 CELL97.1 CELL98.1 CELL99.1 CELL100.1 CELL101.1 CELL102.1 CELL103.1 IC1.15(VREF) IC1.16(VDD) IC2.15(VREF) IC2.16(VDD) IC3.15(VREF) IC3.16(VDD) IC4.15(VREF) IC4.16(VDD) IC5.15(VREF) IC5.16(VDD) IC6.15(VREF) IC6.16(VDD) IC7.15(VREF) IC7.16(VDD) IC8.15(VREF) IC8.16(VDD) IC9.15(VREF) IC9.16(VDD) IC10.15(VREF) IC10.16(VDD) IC11.15(VREF) IC11.16(VDD) IC12.15(VREF) IC12.16(VDD) IC13.32(VCC) IC14.32(VCC) IC15.32(VCC) IC16.32(VCC) IC17.32(VCC) IC18.9(VDD) IC18.18(!RESET) IC19.9(VDD) IC19.15(A0) IC19.18(!RESET) IC20.9(VDD) IC20.16(A1) IC20.18(!RESET) IC21.9(VDD) IC21.15(A0) IC21.16(A1) IC21.18(!RESET) IC22.9(VDD) IC22.17(A2) IC22.18(!RESET) IC23.9(VDD) IC23.15(A0) IC23.17(A2) IC23.18(!RESET) IC24.9(VDD) IC24.16(A1) IC24.17(A2) IC24.18(!RESET) IC25.9(VDD) IC25.15(A0) IC25.16(A1) IC25.17(A2) IC25.18(!RESET) IC26.15(VREF) IC26.16(VDD) JP1.2 JP2.1 R1.2 R7.1 U1.7(VCC) U1.20(AVCC) U1.21(AREF)
Unconnected: IC13.EXP(PAD) IC14.EXP(PAD) IC15.EXP(PAD) IC16.EXP(PAD) IC17.13(OUT8) IC17.14(OUT9) IC17.15(OUT10) IC17.16(OUT11) IC17.17(OUT12) IC17.18(OUT13) IC17.19(OUT14) IC17.20(OUT15) IC17.21(OUT16) IC17.22(OUT17) IC17.23(OUT18) IC17.24(OUT19) IC17.25(OUT20) IC17.26(OUT21) IC17.27(OUT22) IC17.28(OUT23) IC17.29(SOUT) IC17.EXP(PAD) IC18.6(GPB5) IC18.7(GPB6) IC18.8(GPB7) IC18.19(INTB) IC18.20(INTA) IC19.19(INTB) IC20.19(INTB) IC21.19(INTB) IC22.19(INTB) IC23.19(INTB) IC24.19(INTB) IC25.1(GPB0) IC25.2(GPB1) IC25.3(GPB2) IC25.4(GPB3) IC25.5(GPB4) IC25.6(GPB5) IC25.7(GPB6) IC25.8(GPB7) IC25.19(INTB) ISP.2 JP2.2 JP2.3 JP2.9 JP2.12 JP2.13 JP2.14 JP2.15 JP2.16 JP2.17 JP2.18 JP2.19 U1.12(PD6(AIN0)) U1.13(PD7(AIN1)) U1.14(PB0(ICP)) U1.15(PB1(OC1A)) U1.27(PC4(ADC4/SDA)) U1.28(PC5(ADC5/SCL))

## Notes on the sheet
- Blanks display during
  controller reset
- Controls lighting
- ADCs for light sensors
- USB-C Power
- Reads button states
- Controls ADC SPI comms
- 1 | 2 | 3
- 4 | 5 | 6 | 7

## Library data of the parts
C1-C8 = rcl:C-EU: CAPACITOR, European symbol; SPICEPREFIX: C
CELL0 CELL1-CELL103 = pinhead:PINHD-1X5: PIN HEADER
IC1-IC12 IC26 = adafruit:MCP3008
IC13-IC17 = adafruit:TLC5947
IC18-IC25 = microchip:MCP23S17: http://ww1.microchip.com/downloads/en/DeviceDoc/21952a.pdf Source: http://ww1.microchip.com/downloads/en/DeviceDoc/21952a.pdf; MF: MICROCHIP; MPN: MCP23S17-E/SP; OC_FARNELL: 1292238; OC_NEWARK: 31K2951
ISP = Wurth_Elektronik_Electromechanic_Wire_to_Board_Connectors_rev19a:61200621621: WR-BHD 2.54mm Male Box Header, 6 Pins=>Code : Con_WTB_BHD_2.54_Male_THT_WS_61200621621 <http://katalog.we-online.de/media/thumbs2/eican/thb_Con_WTB_BHD_2.54_Male_THT_WS_6120xx21621_pf2.jpg> Details see: http://katalog.we-online.de/en/em/612_0xx_216_21 Created 2014-06-04, Karrer Zheng 2014 (C) Würth Elektronik
JP1 = adafruit:PINHD-1X8: PIN HEADER
JP2 = pinhead:PINHD-2X10: PIN HEADER
JP3 = adafruit:PINHD-1X3: PIN HEADER
Q1 = adafruit:CRYSTAL: CRYSTAL; OC_FARNELL: 1667008; OC_NEWARK: unknown
R1-R111 = rcl:R-US_: RESISTOR, American symbol; SPICEPREFIX: R
U1 = SparkFun-IC-Microcontroller:ATMEGA328P_PDIP: Atmel 328P Through hole ATMEGA328P uC used in the Arduino 32kb flash, 1k EEPROM, 2k SRAM Datasheet <http://www.sparkfun.com/datasheets/Components/SMD/ATMega328.pdf> SparkFun Products Storefront component: AVR 28 Pin 20MHz 32K 6A/D - ATMega328P <https://www.sparkfun.com/products/9061> (COM-09061) SparkFun Simon Says - Through-Hole Soldering Kit <https://www.sparkfun.com/products/10547> (KIT-10547) SparkFun Learn to Solder - Simon Says <https://www.sparkfun.com/products/13708> (KIT-13708) SparkFun BigTime Watch Kit <https://www.sparkfun.com/products/11734> (KIT-11734) SparkFun ClockIt <https://www.sparkfun.com/products/10930> (KIT-10930) SparkFun Serial Enabled LCD Kit <https://www.sparkfun.com/products/10097> (LCD-10097) SparkFun Simon Tilts - Through Hole Soldering Kit <https://www.sparkfun.com/products/12634> (KIT-12634) SparkFun Frequency Counter Kit <https://www.sparkfun.com/products/10140> (KIT-10140) FabFM Radio Kit <https://www.sparkfun.com/products/11043> (KIT-11043) SparkFun Binary Blaster Kit <https://www.sparkfun.com/products/12037> (KIT-12037) SparkFun Metro-Gnome <https://www.sparkfun.com/products/9236> (KIT-09236) ATmega328 with Arduino Optiboot (Uno) <https://www.sparkfun.com/products/10524> (DEV-10524); PROD_ID: IC-09136